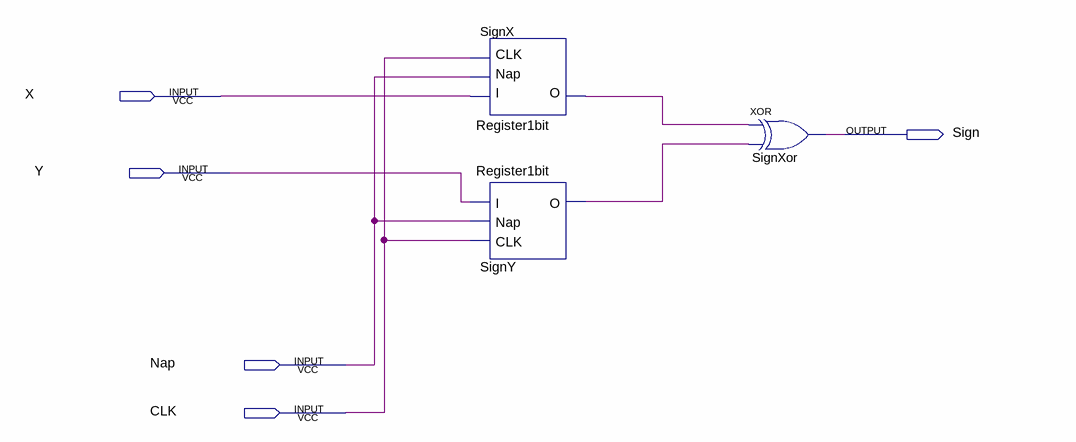
[diagram p0: schematic sheet]
// Quartus schematic Sign.bdf as structural Verilog: 3 symbols, 5 pins
module Sign (
  input  X,
  input  Y,
  input  Nap,
  input  CLK,
  output Sign
);

  wire SignX_o, SignY_o;

  Register1bit SignX (.I(X), .Nap(Nap), .CLK(CLK), .O(SignX_o));
  Register1bit SignY (.I(Y), .Nap(Nap), .CLK(CLK), .O(SignY_o));
  xor SignXor (Sign, SignX_o, SignY_o);
endmodule
